# EAGLE design Design1 (EAGLE 8.5.2)
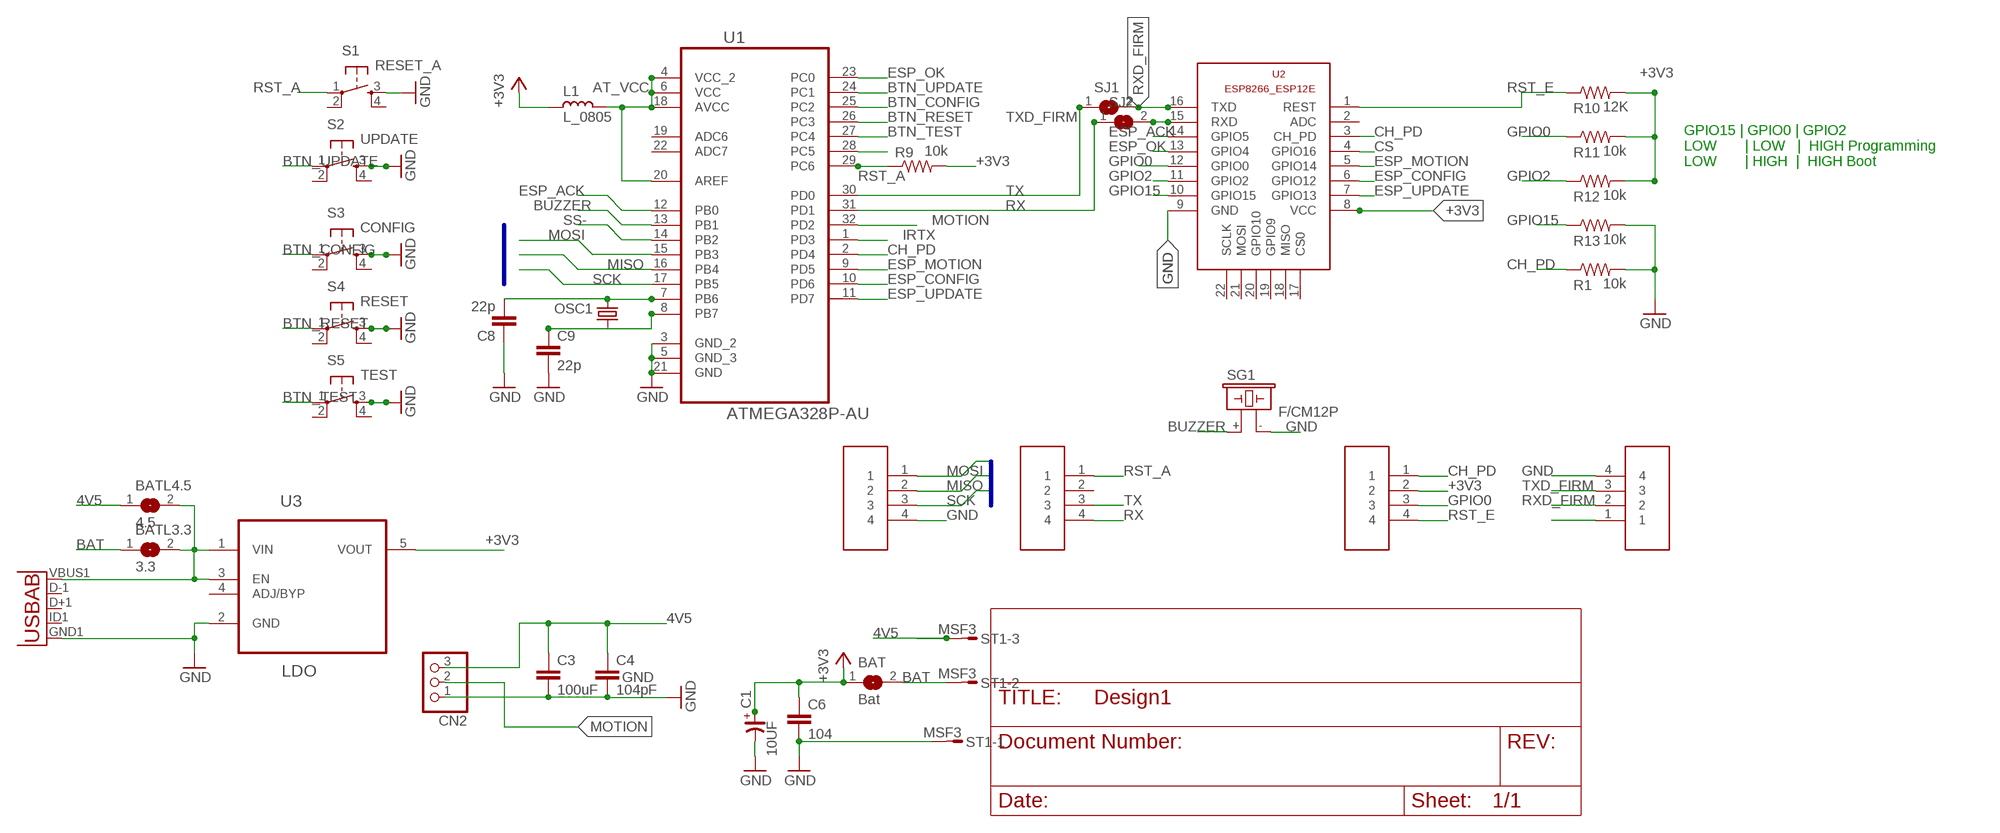
[diagram p0: schematic, sheet 1]

## Parts
BAT  Bat  SJ  [SJ]
BATL3.3  3.3  SJ  [SJ]
BATL4.5  4.5  SJ  [SJ]
C1  10UF  CP_6032  [C6032/T]
C3  100uF  C-EUC0805  [C0805]
C4  104pF  C-EUC0805  [C0805]
C6  104  C-EUC0805  [C0805]
C8  22p  C-EUC0805K  [C0805K]
C9  22p  C-EUC0805K  [C0805K]
CN1  USB""  [USB-MICRO-SMD]
CN2  PINHD-1X3  [1X03]
CON1  AT1  FIRM_PADSSMD_FIRM_PADS  [FIRM_PADS]
CON2  AT2  FIRM_PADSSMD_FIRM_PADS  [FIRM_PADS]
CON3  ESP1  FIRM_PADSSMD_FIRM_PADS  [FIRM_PADS]
CON4  ESP2  FIRM_PADSSMD_FIRM_PADS  [FIRM_PADS]
L1  L_0805  [L0805]
OSC1  CRYSTALSM49  [SM49]
R1  10k  0.75OHM-1/4W-1%(0805)  [0805]
R9  10k  0.75OHM-1/4W-1%(0805)  [0805]
R10  12K  0.75OHM-1/4W-1%(0805)  [0805]
R11  10k  0.75OHM-1/4W-1%(0805)  [0805]
R12  10k  0.75OHM-1/4W-1%(0805)  [0805]
R13  10k  0.75OHM-1/4W-1%(0805)  [0805]
S1  RESET_A  DTSM-6  [DTSM-6]
S2  UPDATE  DTSM-6  [DTSM-6]
S3  CONFIG  DTSM-6  [DTSM-6]
S4  RESET  DTSM-6  [DTSM-6]
S5  TEST  DTSM-6  [DTSM-6]
SG1  F/CM12P  [F/CM12P]
SJ1  SJ  [SJ]
SJ2  SJ  [SJ]
ST1  MSF3  [MSF3]
U1  ATMEGA328P-AU  [QFP80P900X900X120-32N]
U2  ESP8266-12EESP8266-ESP12E  [ESP8266-ESP12E]
U3  LDO  SPX3819M5-L-3-3  [SOT95P280X145-5N]

## Nets
4V5 [Supply]: BATL4.5.1 C3.1 C4.1 CN2.3 ST1.3
+3V3 [Supply]: BAT.1 C1.+ C6.1 CON3.2 L1.2 R9.2 R10.2 R11.2 R12.2 U2.8(VCC) U3.5(VOUT)
AT_VCC [Supply]: L1.1 U1.4(VCC_2) U1.6(VCC) U1.18(AVCC) U1.20(AREF)
BAT: BAT.2 BATL3.3.1 ST1.2
BTN_CONFIG: S3.1 U1.25(PC2)
BTN_RESET: S4.1 U1.26(PC3)
BTN_TEST: S5.1 U1.27(PC4)
BTN_UPDATE: S2.1 U1.24(PC1)
BUZZER: SG1.+ U1.13(PB1)
CH_PD: CON3.1 R1.1 U1.2(PD4) U2.3(CH_PD)
CS: U2.4(GPIO16)
ESP_ACK: U1.12(PB0) U2.14(GPIO5)
ESP_CONFIG: U1.10(PD6) U2.6(GPIO12)
ESP_MOTION: U1.9(PD5) U2.5(GPIO14)
ESP_OK: U1.23(PC0) U2.13(GPIO4)
ESP_UPDATE: U1.11(PD7) U2.7(GPIO13)
GND: C1.- C3.2 C4.2 C6.2 C8.1 C9.2 CN1.GND1(GND) CN2.1 CON1.4 CON4.4 R1.2 R13.2 S1.3 S2.3 S3.3 S4.3 S5.3 SG1.- ST1.1 U1.3(GND_2) U1.5(GND_3) U1.21(GND) U2.9(GND) U3.2(GND)
GPIO0: CON3.3 R11.1 U2.12(GPIO0)
GPIO2: R12.1 U2.11(GPIO2)
GPIO15: R13.1 U2.10(GPIO15)
IRTX: U1.1(PD3)
MISO: CON1.2 U1.16(PB4)
MOSI: CON1.1 U1.15(PB3)
MOTION: CN2.2 U1.32(PD2)
N$1 [Supply]: BATL3.3.2 BATL4.5.2 CN1.VBUS1(VBUS) U3.1(VIN) U3.3(EN)
N$3: C8.2 OSC1.1 U1.7(PB6)
N$4: CON4.1
N$13 [Supply]: C9.1 OSC1.2 U1.8(PB7)
N$18: U1.28(PC5)
RST_A: CON2.1 R9.1 S1.1 U1.29(PC6)
RST_E: CON3.4 R10.1 U2.1(REST)
RX: CON2.4 SJ2.1 U1.31(PD1)
RXD_FIRM: CON4.2 SJ1.2 U2.16(TXD)
SCK: CON1.3 U1.17(PB5)
SS-: U1.14(PB2)
TX: CON2.3 SJ1.1 U1.30(PD0)
TXD_FIRM: CON4.3 SJ2.2 U2.15(RXD)
Unconnected: CN1.D+1(D+) CN1.D-1(D-) CN1.ID1(USBID) CON2.2 S1.2 S1.4 S2.2 S2.4 S3.2 S3.4 S4.2 S4.4 S5.2 S5.4 U1.19(ADC6) U1.22(ADC7) U2.2(ADC) U2.17(CS0) U2.18(MISO) U2.19(GPIO9) U2.20(GPIO10) U2.21(MOSI) U2.22(SCLK) U3.4(ADJ/BYP)

## Buses
ISP

## Notes on the sheet
- GPIO15 | GPIO0 | GPIO2 
  LOW       | LOW   |  HIGH Programming
  LOW       | HIGH  |  HIGH Boot

## Library data of the parts
BAT BATL3.3 BATL4.5 SJ1 SJ2 = jumper:SJ: SMD solder JUMPER
C1 = rc-master-smd:CP_: POLARIZED CAP
C3 C4 C6 C8 C9 = rcl:C-EU: CAPACITOR, European symbol
CN1 = MicroUSB:USB: This is a USB AB connector that is compatible with USB OTG. i.e. this connector can serve as a host or device
CN2 = pinhead:PINHD-1X3: PIN HEADER
CON1-CON4 = firm_pads:FIRM_PADS
L1 = rc-master-smd:L_: INDUCTOR
OSC1 = crystal:CRYSTAL: CRYSTAL; OC_FARNELL: unknown; OC_NEWARK: unknown
R1 R9-R13 = SMD Resistors:0.75OHM-1/4W-1%(0805): RES-08474; PROD_ID: RES-08474; VALUE: 0.75
S1-S5 = switch-tact:DTSM-6
SG1 = buzzer:F/CM12P: BUZZER Source: Buerklin; OC_FARNELL: unknown; OC_NEWARK: unknown
ST1 = con-lumberg:MSF3: MSF CONNECTOR; OC_FARNELL: unknown; OC_NEWARK: unknown
U1 = Atmel_By_element14_Batch_1-00:ATMEGA328P-AU: 8-bit Microcontroller with In-System Programmable Flash; MPN: ATMEGA328P-AU; OC_FARNELL: 1715486; OC_NEWARK: 14R4631; PACKAGE: TQFP-32; SUPPLIER: Atmel
U2 = ESP12E:ESP8266-12E: ESP8266-12E with additional I/O and GPIO04/05 corrected The author cannot warrant that this library is free from error or will meet your specific requirements. Created by PuceBaboon.com. Komagane, Nagano, JAPAN
U3 = SPX3819M5-L-3-3:SPX3819M5-L-3-3: 500mA, LOW-NOISE LDO VOLTAGE REGULATOR

## Net classes
0 default: width 0.305 mm, drill 0.508 mm, clearance 0.254 mm
1 Supply: width 0.508 mm

## Board
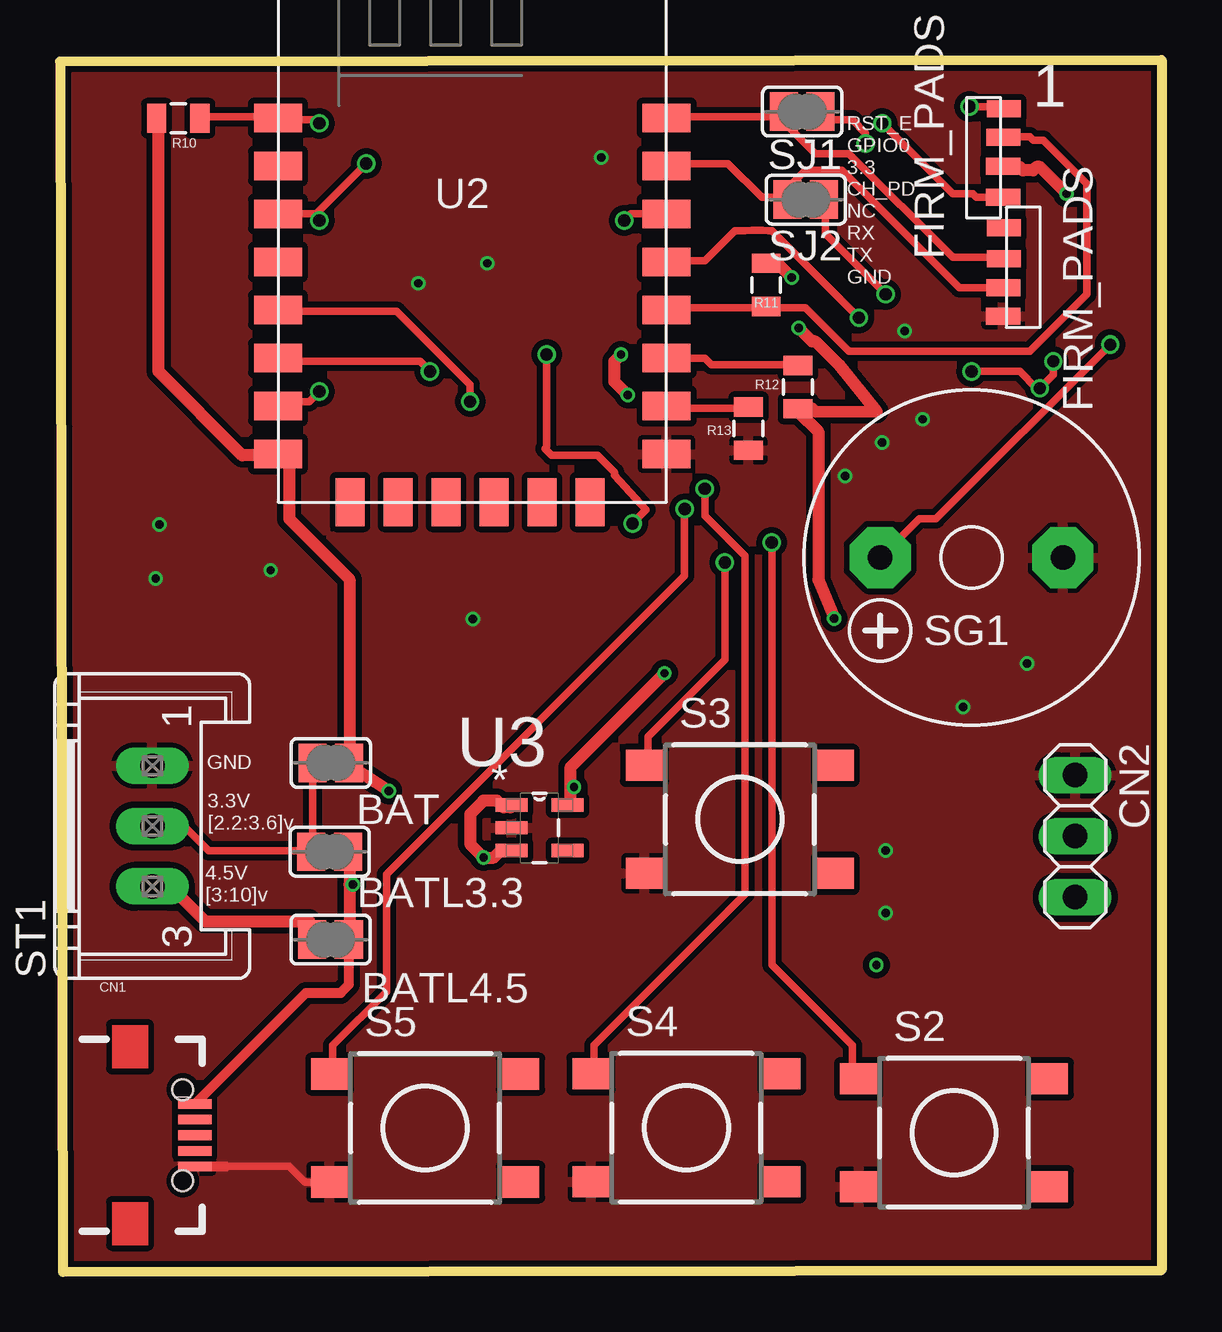
[diagram p1: board, top side]
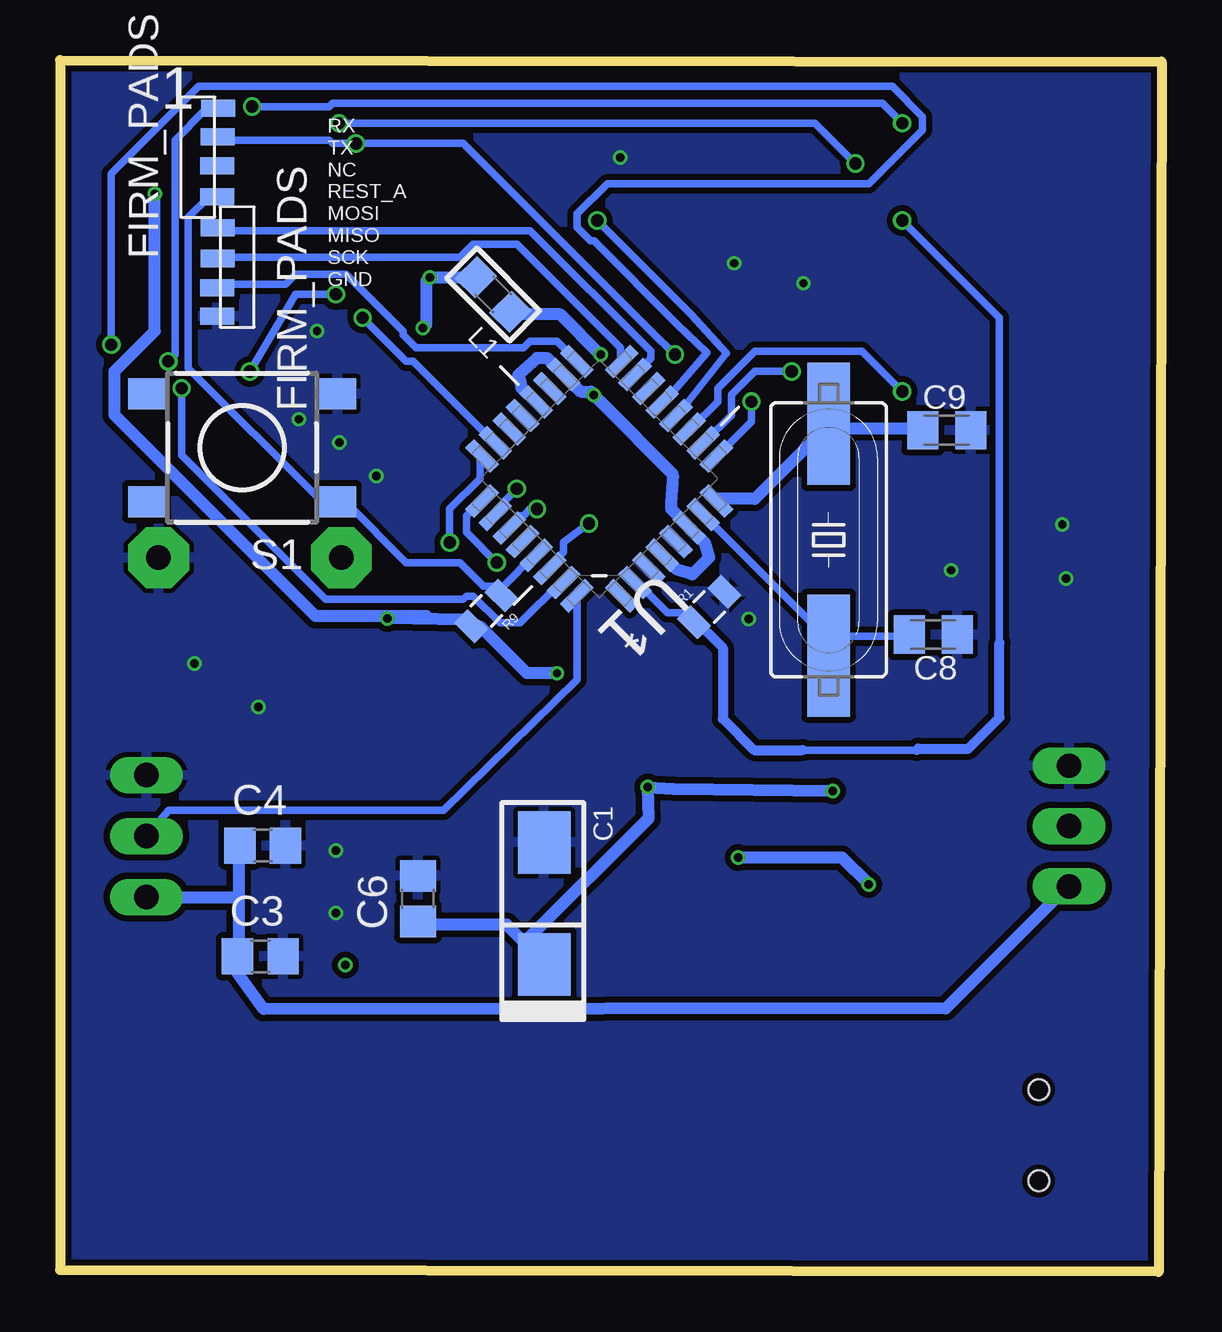
[diagram p2: board, bottom side, seen from below]

Size 45.92 x 50.49 mm. Coordinates in mm from the lower left corner, seen from the top.
Outline: 45.92,50.49 0,50.42 0.12,0 45.92,0.07 45.92,50.49
Copper layers (1*16): Top 0.018mm / dielectric 1.55mm / Bottom 0.018mm
Design rules "eC_2Layer_PClass6_BaseCopperO18_eCDefault": minimum track width 0.15mm, minimum drill 0.35mm, track to track 0.15mm, track to pad 0.15mm, pad to pad 0.15mm, via to via 0.15mm, smd to smd 0mil, copper to edge 0.25mm, drill to drill 0.35mm, minimum pad ring 0.175mm, minimum via ring 0.125mm, stop-mask expansion 0mil, vias tented up to drill 0.45mm, thermal gap 0.2mm

### Footprints (pad centres in the part's own frame; a part is rotated, then mirrored left to right if it is on the bottom)
SJ = smd 1.168 x 1.6: 1 -0.762,0; 2 0.762,0
C6032/T = smd 2.6 x 2.2: + 2.54,0; - -2.54,0
C0805 = smd 1.3 x 1.5: 1 -0.95,0; 2 0.95,0
C0805K = smd 1.3 x 1.6: 1 -1,0; 2 1,0
USB-MICRO-SMD = smd 1.4 x 0.4: D+1 2.7,0; D-1 2.7,0.65; GND1 2.7,-1.3; ID1 2.7,-0.65; VBUS1 2.7,1.3 | hole 0.85: 2.2,1.9; 2.2,-1.9
1X03 = drill 1.016 long: 1 -2.54,0; 2 0,0; 3 2.54,0
FIRM_PADS = smd 0.711 x 1.422: 1 0.85,-0.1; 2 2.14,-0.1; 3 3.35,-0.12; 4 4.54,-0.13
L0805 = smd 1.2 x 1.3: 1 -1.016,0; 2 1.016,0
SM49 = smd 5.08 x 1.778: 1 -4.826,0; 2 4.826,0
0805 = smd 0.8 x 1.2: 1 -0.9,0; 2 0.9,0
DTSM-6 = smd 1.55 x 1.3: 1 -3.975,2.25; 2 3.975,2.25; 3 -3.975,-2.25; 4 3.975,-2.25
F/CM12P = drill 1.016 pad 2.54 octagon: + 3.81,0; - -3.81,0
MSF3 = drill 1.016 long: 1 2.515,-2.54; 2 0,-2.54; 3 -2.515,-2.54
QFP80P900X900X120-32N = smd 1.473 x 0.508: 1 -4.115,2.794; 2 -4.115,2.007; 3 -4.115,1.194; 4 -4.115,0.406; 5 -4.115,-0.406; 6 -4.115,-1.194; 7 -4.115,-2.007; 8 -4.115,-2.794; 17 4.115,-2.794; 18 4.115,-2.007; 19 4.115,-1.194; 20 4.115,-0.406; 21 4.115,0.406; 22 4.115,1.194; 23 4.115,2.007; 24 4.115,2.794 | smd 0.508 x 1.473: 9 -2.794,-4.115; 10 -2.007,-4.115; 11 -1.194,-4.115; 12 -0.406,-4.115; 13 0.406,-4.115; 14 1.194,-4.115; 15 2.007,-4.115; 16 2.794,-4.115; 25 2.794,4.115; 26 2.007,4.115; 27 1.194,4.115; 28 0.406,4.115; 29 -0.406,4.115; 30 -1.194,4.115; 31 -2.007,4.115; 32 -2.794,4.115
ESP8266-ESP12E = smd 2 x 1.2: 1 0,16; 2 0,14; 3 0,12; 4 0,10; 5 0,8; 6 0,6; 7 0,4; 8 0,2; 9 16.2,2; 10 16.2,4; 11 16.2,6; 12 16.2,8; 13 16.2,10; 14 16.2,12; 15 16.2,14; 16 16.2,16 | smd 1.2 x 2: 17 11,0; 18 3,0; 19 5,0; 20 13,0; 21 7,0; 22 9,0
SOT95P280X145-5N = smd 1.321 x 0.559: 1 -1.168,0.94; 2 -1.168,0; 3 -1.168,-0.94; 4 1.168,-0.94; 5 1.168,0.94

### Placement (x,y rotation side)
BAT  11.29,21.2 180 top
BATL3.3  11.24,17.5 0 top
BATL4.5  11.28,13.84 0 top
C1  25.73,15.35 270 bottom
C3  37.57,13.14 0 bottom
C4  37.47,17.76 0 bottom
C6  31,15.54 90 bottom
C8  9.52,26.55 180 bottom
C9  8.96,35.06 0 bottom
CN1  2.92,5.69 0 top
CN2  42.31,18.15 270 top
CON1  39.24,44.36 270 bottom
CON2  39.46,43.94 90 bottom
CON3  39.21,43.92 90 top
CON4  39.44,44.35 270 top
L1  27.86,40.72 135 bottom
OSC1  13.88,30.5 90 bottom
R1  18.86,27.7 45 bottom
R9  28.15,27.54 225 bottom
R10  4.93,48.06 180 top
R11  29.44,41.12 90 top
R12  30.76,36.86 270 top
R13  28.7,35.13 270 top
S1  38.33,34.34 180 bottom
S2  37.27,5.79 0 top
S3  28.34,18.85 0 top
S4  26.11,6 0 top
S5  15.22,5.99 0 top
SG1  38,29.76 180 top
SJ1  30.94,48.34 180 top
SJ2  31.09,44.67 180 top
ST1  1.31,18.57 90 top
U1  23.44,33.05 135 bottom
U2  9.09,32.07 0 top
U3  19.99,18.5 0 top

### Tracks (layer width: path | path; a pad name or v marks a point on that pad's centre or on a via)
4V5
  Top 0.508: BATL4.5.1 10.39,14.6 6.06,14.6 4.66,16 3.96,16 ST1.3
  Bottom 0.508: 38.47,15.58 38.47,17.68 C4.1 | 38.47,15.58 38.47,13.2 C3.1 38.88,12.96 37.42,10.94 8.99,10.97 3.96,16 ST1.3 | 38.47,15.58 42.24,15.58 CN2.3
+3V3  (via drill 0.35)
  Top 0.508: R10.2 4.11,47.99 4.11,37.51 7.6,34.02 8.99,34.02 U2.8 9.27,33.88 9.55,33.6 9.55,31.37 12.07,28.85 12.07,21.31 BAT.1 12.21,21.03 v13.71,20.04 | v30.51,41.42 29.95,41.98 29.53,41.98 R11.2 | v25.2,24.94 21.29,21.03 21.29,20.19 | 21.29,20.19 21.29,19.49 U3.5 | v41.96,44.92 40.85,46.03 40.71,46.03 40.57,45.9 40.15,45.9 40.01,46.03 39.45,46.03 CON3.2 | v30.79,39.33 31.35,38.77 31.49,38.77 32.46,37.79 34.03,35.85 31.49,35.84 31.35,35.98 30.93,35.98 R12.2 30.79,35.84 31.61,35.01 31.61,28.84 v32.28,27.23 | v21.43,20.19 21.29,20.19
  Bottom 0.508: C6.1 30.93,14.46 27.3,14.46 25.76,12.93 C1.+ 26.4,13.89 21.4,18.87 v21.43,20.19 20.35,20.12 v13.71,20.04 | L1.2 28.69,41.42 v30.51,41.42 30.65,41.28 30.65,39.47 v30.79,39.33 | v25.2,24.94 26.46,24.94 28.41,26.9 28.69,26.9 R9.2 28.97,27.04 29.11,27.18 v32.28,27.23 30.65,27.32 35.26,27.32 43.64,35.7 43.64,37.51 41.96,39.19 v41.96,44.92
AT_VCC  (via drill 0.35)
  Top 0.508: v23.38,38.21 23.1,37.93 23.1,37.09 v23.66,36.53
  Bottom 0.508: U1.4 20.76,29.81 20.2,29.25 19.56,29.06 18.86,29.76 19.05,30.39 19.61,30.95 U1.6 19.8,31.12 19.89,31.23 20.45,31.78 20.45,32.06 20.37,33.22 23.38,36.26 v23.66,36.53 23.8,36.67 24.22,36.67 U1.18 25.06,37.51 25.62,38.07 26.04,38.07 26.81,37.37 26.69,36.83 26.09,36.27 U1.20 | v23.38,38.21 25.06,39.89 27.02,39.89 L1.1
BAT
  Top 0.305: BAT.2 10.53,21.17 10.53,17.54 BATL3.3.1 10.39,17.54 6.2,17.54 5.22,18.51 3.96,18.51 ST1.2
BTN_CONFIG  (via drill 0.51)
  Top 0.305: v27.71,29.55 27.71,25.5 24.5,22.29 24.5,21.17 S3.1
  Bottom 0.305: v27.71,29.55 28.97,30.81 28.97,31.51 28.41,32.06 U1.25
BTN_RESET  (via drill 0.51)
  Top 0.305: v26.88,32.62 26.88,31.51 28.55,29.83 28.55,15.72 22.27,9.43 22.27,8.32 S4.1
  Bottom 0.305: v26.88,32.62 27.44,32.06 27.44,31.92 27.71,31.65 U1.26
BTN_TEST  (via drill 0.51)
  Top 0.305: v26.04,31.78 26.04,28.99 13.61,16.56 13.61,11.67 11.37,9.43 11.37,8.32 S5.1
  Bottom 0.305: v26.04,31.78 26.18,31.65 26.32,31.78 26.6,31.51 26.74,31.51 27.16,31.09 U1.27
BTN_UPDATE  (via drill 0.51)
  Top 0.305: v29.67,30.39 29.67,12.79 33.02,9.43 33.02,8.32 33.16,8.18 S2.1
  Bottom 0.305: v29.67,30.39 29.67,31.78 28.41,33.04 28.41,33.88 U1.24
BUZZER  (via drill 0.51)
  Top 0.305: v43.78,38.63 36.52,31.37 35.82,31.37 34.28,29.83 SG1.+
  Bottom 0.305: v43.78,38.63 43.78,45.76 40.15,49.39 11.23,49.39 9.97,48.13 9.97,47.57 12.21,45.34 23.1,45.34 24.36,44.08 24.36,43.52 23.8,42.96 23.66,42.96 20.17,39.47 18.96,38.29 20.73,36.26 U1.13
CH_PD  (via drill 0.51)
  Top 0.305: v34.28,47.85 37.21,44.92 38.05,44.92 38.19,44.78 CON3.1 | 10.67,44.08 v12.77,46.17 | 10.67,44.08 9.13,44.08 U2.3 | v10.81,43.8 10.67,43.94 10.67,44.08
  Bottom 0.305: U1.2 21.85,28.71 20.59,27.45 20.03,27.45 R1.1 19.89,27.32 19.61,27.32 | v34.28,47.85 14.44,47.85 v12.77,46.17 | 14.97,21.73 10.22,21.73 | 6.76,26.2 6.76,39.75 v10.81,43.8
  Bottom 0.406: 19.61,27.32 18.29,25.99 18.29,23.04 16.98,21.73 14.97,21.73 | 10.22,21.73 10.16,21.8 8.05,21.8 6.76,23.09 6.76,26.2
ESP_ACK  (via drill 0.51)
  Top 0.305: v23.52,43.8 23.8,44.08 25.2,44.08 U2.14
  Bottom 0.305: v23.52,43.8 19.61,39.89 18.13,38.27 20.17,35.7 U1.12
ESP_CONFIG  (via drill 0.51)
  Top 0.305: v15.42,37.51 15,37.93 9.13,37.93 U2.6
  Bottom 0.305: v15.42,37.51 16.96,37.51 17.94,36.53 17.94,35.7 19.05,34.58 U1.10
ESP_MOTION  (via drill 0.51)
  Top 0.305: v17.1,36.26 17.1,36.95 14.02,40.03 9.13,40.03 U2.5
  Bottom 0.305: v17.1,36.26 17.1,35.42 18.49,34.02 U1.9
ESP_OK  (via drill 0.51)
  Top 0.305: v33.3,39.75 29.67,43.38 29.53,43.38 29.27,43.39 28.85,43.39 28.55,43.38 28.13,43.38 26.88,42.12 25.34,42.12 U2.13
  Bottom 0.305: v33.3,39.75 31.49,37.93 31.21,37.93 27.85,34.58 U1.23
ESP_UPDATE  (via drill 0.51)
  Top 0.305: v10.81,36.67 10.39,36.26 9.27,36.26 9.13,36.12 U2.7
  Bottom 0.305: v10.81,36.67 12.49,38.35 16.96,38.35 18.49,36.81 18.49,36.26 19.61,35.14 U1.11
GND  (via drill 0.35)
  Top 0.305: 6.91,4.39 9.56,4.39 10.22,3.73 S5.3 11.3,3.78
  Top 0.406: CN1.GND1 6.91,4.39
  other vias: 32.73,33.16 34.27,34.56 35.96,35.52 35.2,39.2 37.65,23.53 40.32,25.34 3.99,28.89 4.14,31.14 8.78,29.23 14.93,41.19 17.81,42.02 22.57,46.43 17.21,27.2 34.42,17.56 34.42,14.94
  pour Top: 48.82,52.49 -0.61,52.4 -0.93,-0.69 48.5,-0.6
  pour Bottom: 48.93,52.9 -1.02,52.77 -1.19,-2.79 48.72,-2.74 arc7
GPIO0
  Top 0.305: U2.12 25.34,40.17 29.39,40.17 R11.1 29.53,40.17 31.07,40.17 32.88,38.35 40.43,38.35 42.8,40.73 42.8,45.34 40.99,47.15 40.57,47.15 40.43,47.29 39.45,47.29 CON3.3
GPIO2
  Top 0.305: R12.1 30.65,37.79 27.16,37.79 26.88,38.07 25.34,38.07 U2.11
GPIO15
  Top 0.305: R13.1 28.69,35.98 25.34,35.98 U2.10
MISO
  Bottom 0.305: CON1.2 39.31,42.26 29.25,42.26 28.69,42.82 26.88,42.82 22.55,38.49 22.55,38.07 U1.16
MOSI
  Bottom 0.305: CON1.1 39.31,43.38 26.32,43.38 21.29,38.35 21.29,38.07 21.85,37.51 U1.15
MOTION
  Bottom 0.305: U1.32 24.36,24.66 29.94,19.23 41.39,19.23 42.24,18.23 CN2.2
N$1  (via drill 0.35)
  Top 0.406: CN1.VBUS1 10.25,11.62 11.7,11.62 12.05,11.97 BATL4.5.2
  Top 0.508: U3.3 18.77,17.54 18.35,17.54 18.07,17.26 v17.66,17.26 17.1,17.82 17.1,19.07 17.66,19.63 18.21,19.63 18.49,19.35 18.77,19.35 U3.1 | 12.07,16.14 12.07,17.4 BATL3.3.2 | 12.07,16.14 12.07,14.6 BATL4.5.2 | v12.21,16.14 12.07,16.14
  Bottom 0.508: v17.66,17.26 13.32,17.26 v12.21,16.14
N$2  (via drill 0.35)
  other vias: 34.03,12.79
N$3
  Bottom 0.305: U1.7 19.05,31.51 13.88,26.34 13.88,25.78 OSC1.1 13.88,26.48 10.53,26.48 C8.2
N$13
  Bottom 0.508: U1.8 18.49,32.2 16.96,32.2 13.88,35.28 OSC1.2 13.74,35.14 9.97,35.14 C9.1
RST_A
  Bottom 0.305: U1.29 26.18,29.83 27.44,28.57 27.44,28.29 R9.1 27.57,28.57 28.27,28.57 29.25,29.55 31.49,29.55 34,32.06 34.28,32.06 S1.1 34.42,32.2 35.12,32.2 40.57,37.65 40.57,43.94 39.73,44.78 39.45,44.78 CON2.1
RST_E  (via drill 0.51)
  Top 0.305: R10.1 5.92,48.13 8.99,48.13 U2.1 9.13,47.99 10.67,47.99 v10.81,47.85 | v37.91,48.55 39.31,48.55 CON3.4
  Bottom 0.305: v37.91,48.55 34.7,48.55 34.56,48.69 11.65,48.69 v10.81,47.85
RX  (via drill 0.51)
  Top 0.305: v41.4,37.93 41.4,37.37 v40.85,36.81 40.71,36.81 40.01,37.51 v38,37.51 | v34.42,40.73 31.9,43.24 31.9,44.64 SJ2.1
  Bottom 0.305: v41.4,37.93 41.12,38.21 41.12,47.15 39.87,48.41 39.45,48.41 CON2.4 | v40.85,36.81 40.85,34.02 34.84,28.01 29.11,28.01 28.97,28.15 28.69,28.15 27.57,27.04 26.74,27.04 25.06,28.71 U1.31 | v34.42,40.73 36.1,40.73 v38,37.51
RXD_FIRM
  Top 0.305: CON4.2 39.31,42.26 37.21,42.26 32.88,46.59 31.49,46.59 30.23,47.85 30.23,48.27 SJ1.2 30.09,48.13 25.34,48.13 U2.16
SCK
  Bottom 0.305: CON1.3 39.31,41.15 36.52,41.15 36.1,41.56 34,41.56 31.63,39.19 31.63,39.05 31.07,38.49 26.6,38.49 26.32,38.77 25.2,38.77 24.5,38.07 U1.17
TX  (via drill 0.51)
  Top 0.305: v33.58,47.01 33.58,47.43 33.02,47.99 32.04,47.99 31.77,48.27 SJ1.1 | v23.87,31.18 24.42,31.76 23.1,33.18 23.1,33.32 22.41,34.02 20.49,34.02 20.21,34.3 20.29,34.38 v20.29,38.22
  Bottom 0.305: CON2.3 39.31,47.15 34.7,47.15 34.56,47.01 v33.58,47.01 29.11,47.01 21.3,39.21 v20.29,38.22 | v23.87,31.18 24.92,30.39 24.92,29.97 25.48,29.41 U1.30
TXD_FIRM
  Top 0.305: CON4.3 37.49,41.01 32.6,45.9 31.07,45.9 30.37,45.2 30.37,44.78 SJ2.2 30.23,44.78 29.25,44.78 27.85,46.17 25.34,46.17 U2.15

### Text on the board
tPlace: 1 | RST_E / GPIO0 / 3.3 / CH_PD / NC / RX / TX / GND | GND | 3.3V / [2.2:3.6]v | 4.5V / [3:10]v
bPlace: 1 | RX / TX / NC / REST_A / MOSI / MISO / SCK / GND
_bplace: * | * | * | *